# EAGLE design md (EAGLE 8.2.2)
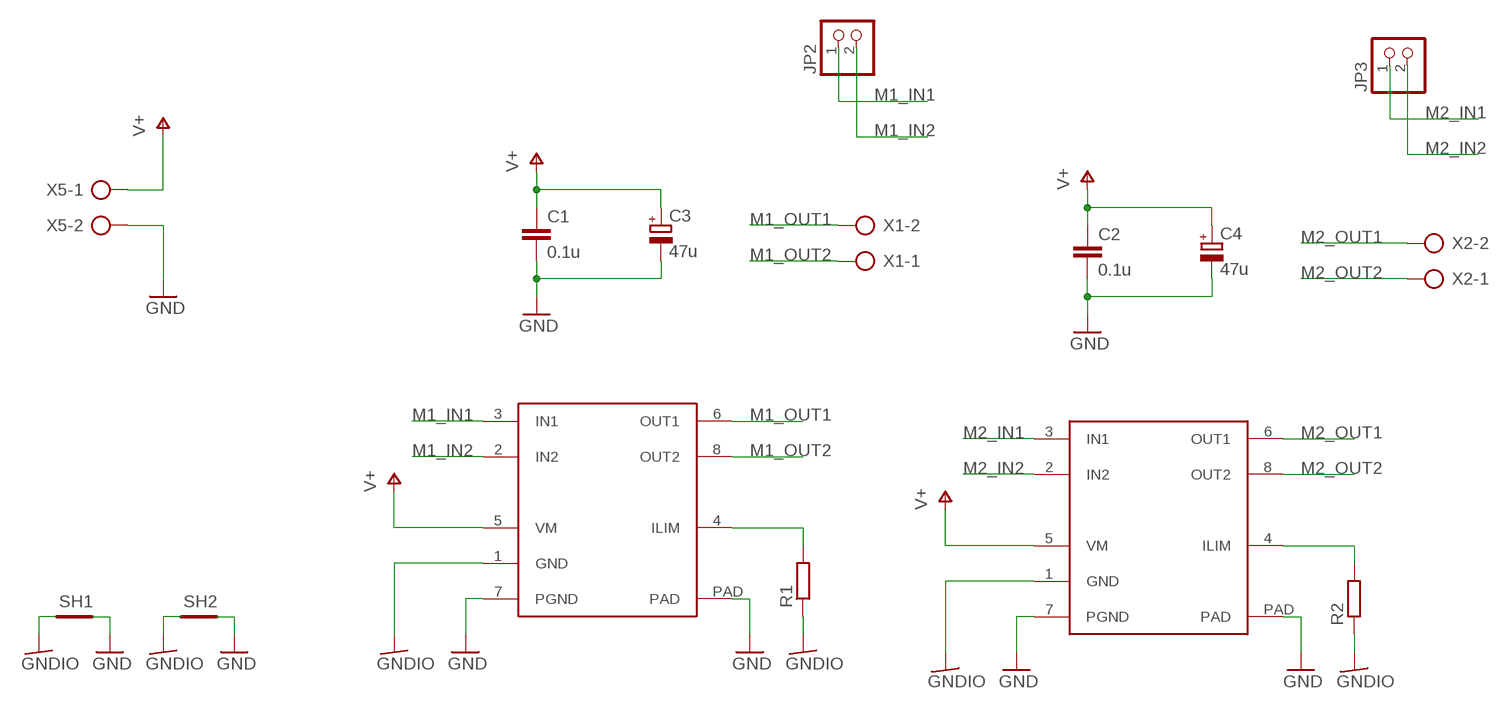
[diagram p0: schematic, sheet 1]

## Parts
C1  0.1u  C-EUC0805  [C0805]
C2  0.1u  C-EUC0805  [C0805]
C3  47u  CPOL-EUE2.5-7  [E2,5-7]
C4  47u  CPOL-EUE2.5-7  [E2,5-7]
JP2  PINHD-1X2  [1X02]
JP3  PINHD-1X2  [1X02]
MD1  DRV8871  [SO8-COOL]
MD2  DRV8871  [SO8-COOL]
R1  R-EU_0207/7  [0207/7]
R2  R-EU_0207/7  [0207/7]
SH1  SHORTT5  [SHORT_TOP-50]
SH2  SHORTT5  [SHORT_TOP-50]
X1  AK300/2  [AK300/2]
X2  AK300/2  [AK300/2]
X5  AK300/2  [AK300/2]

## Nets
GND: C1.2 C2.2 C3.- C4.- MD1.7(PGND) MD1.PAD MD2.7(PGND) MD2.PAD SH1.2 SH2.2 X5.2
GNDIO: MD1.1(GND) MD2.1(GND) R1.1 R2.1 SH1.1 SH2.1
M1_IN1: JP2.1 MD1.3(IN1)
M1_IN2: JP2.2 MD1.2(IN2)
M1_OUT1: MD1.6(OUT1) X1.2
M1_OUT2: MD1.8(OUT2) X1.1
M2_IN1: JP3.1 MD2.3(IN1)
M2_IN2: JP3.2 MD2.2(IN2)
M2_OUT1: MD2.6(OUT1) X2.2
M2_OUT2: MD2.8(OUT2) X2.1
N$1: MD1.4(ILIM) R1.2
N$2: MD2.4(ILIM) R2.2
V+: C1.1 C2.1 C3.+ C4.+ MD1.5(VM) MD2.5(VM) X5.1

## Library data of the parts
C1 C2 = rcl:C-EU: CAPACITOR, European symbol
C3 C4 = rcl:CPOL-EU: POLARIZED CAPACITOR, European symbol
JP2 JP3 = pinhead:PINHD-1X2: PIN HEADER
MD1 MD2 = default:DRV8871
R1 R2 = rcl:R-EU_: RESISTOR, European symbol
SH1 SH2 = shorts:SHORT: Short between two nets; BOM: no
X1 X2 X5 = con-ptr500:AK300/2: CONNECTOR; OC_FARNELL: unknown; OC_NEWARK: unknown

## Board
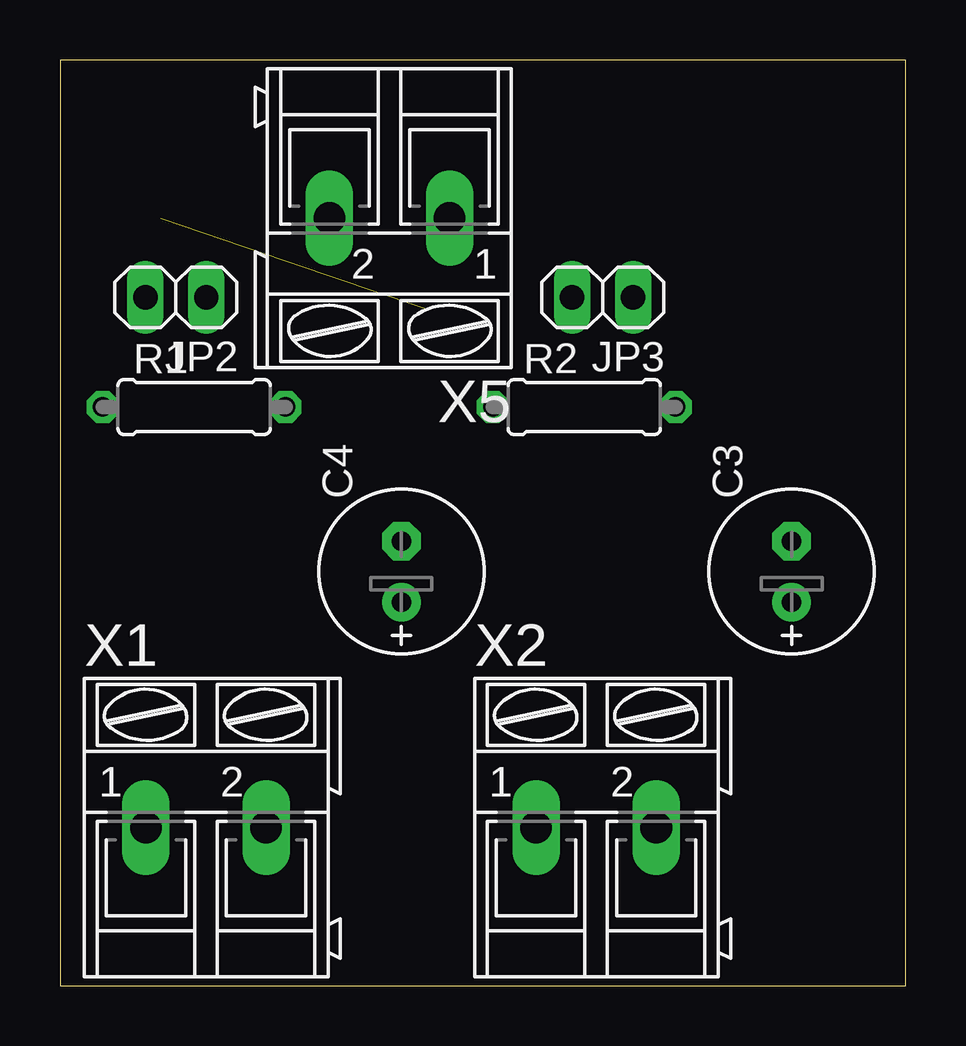
[diagram p1: board, top side]
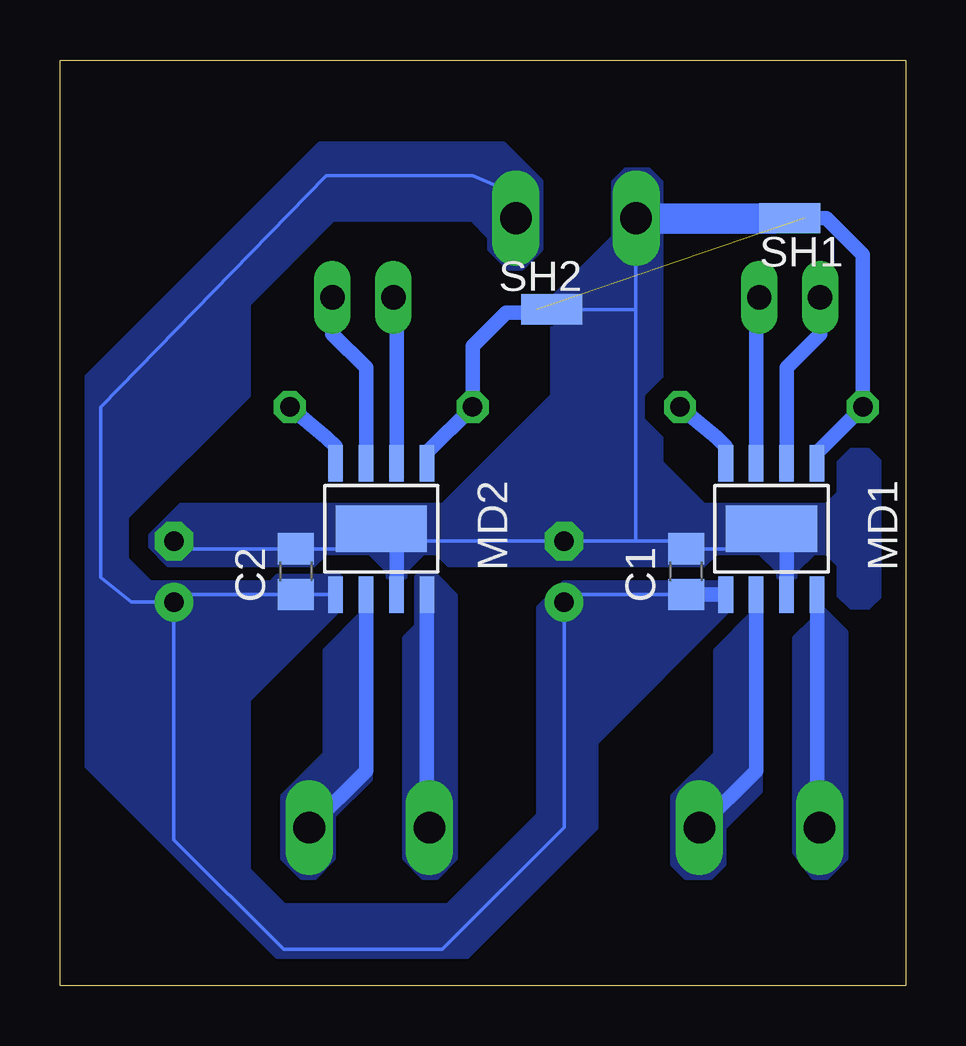
[diagram p2: board, bottom side, seen from below]

Size 35.23 x 38.6 mm. Coordinates in mm from the lower left corner, seen from the top.
Outline: 0,0 35.23,0 35.23,38.6 0,38.6 0,0
Copper layers (1*16): Top 0.035mm / dielectric 1.5mm / Bottom 0.035mm
Design rules "default *": minimum track width 6mil, minimum drill 0.35mm, track to track 3mil, track to pad 3mil, pad to pad 3mil, via to via 3mil, smd to smd 3mil, copper to edge 40mil, drill to drill 6mil, minimum pad ring 10mil, minimum via ring 8mil, stop-mask expansion 4mil, vias tented up to drill 0mil, thermal gap 10mil

### Footprints (pad centres in the part's own frame; a part is rotated, then mirrored left to right if it is on the bottom)
C0805 = smd 1.3 x 1.5: 1 -0.95,0; 2 0.95,0
E2,5-7 = drill 0.813 pad 1.6: + -1.27,0 | drill 0.813 pad 1.6 octagon: - 1.27,0
1X02 = drill 1.016 long: 1 -1.27,0; 2 1.27,0
SO8-COOL = smd 0.61 x 1.524: 1 -1.905,-2.743; 2 -0.635,-2.743; 3 0.635,-2.743; 4 1.905,-2.743; 5 1.905,2.743; 6 0.635,2.743; 7 -0.635,2.743; 8 -1.905,2.743 | smd 3.81 x 1.93: PAD 0,0
0207/7 = drill 0.813 octagon: 1 -3.81,0; 2 3.81,0
SHORT_TOP-50 = smd 1.27 x 1.27: 1 0.635,0; 2 -0.635,0
AK300/2 = drill 1.321 long: 1 -2.515,0; 2 2.489,0

### Placement (x,y rotation side)
C1  9.14,17.27 90 bottom
C2  25.4,17.27 90 bottom
C3  30.48,17.27 90 top
C4  14.22,17.27 90 top
JP2  4.83,28.7 180 top
JP3  22.61,28.7 180 top
MD1  5.59,19.05 180 bottom
MD2  21.84,19.05 180 bottom
R1  5.59,24.13 0 top
R2  21.84,24.13 0 top
SH1  4.83,32 0 bottom
SH2  14.73,28.19 180 bottom
X1  6.1,6.6 0 top
X2  22.35,6.6 0 top
X5  13.72,32 180 top

### Tracks (layer width: path | path; a pad name or v marks a point on that pad's centre or on a via)
GND
  Bottom 0.152: C3.- 30.16,18.22 C2.2 22.67,18.22 MD2.PAD 21.21,18.41 21.21,18.4 20.72,18.4 20.57,18.54 C4.- 11.25,18.54 | 4.95,18.41 MD1.PAD 6.42,18.22 C1.2 9.46,18.54 11.25,18.54 | X5.2 11.25,31.98 11.25,28.19 | 11.25,28.19 11.25,18.54 | SH1.2 5.48,31.98 | 11.25,28.19 SH2.2
  Bottom 0.61: 4.95,18.41 MD1.7 | 21.21,18.4 MD2.7
  Bottom 1.27: 5.48,31.98 11.25,31.98
  pour Bottom (no thermals): 8.38,20.07 3.3,20.07 2.79,20.57 2.79,21.84 2.29,22.35 1.52,22.35 1.02,21.84 1.02,16.26 1.52,15.75 2.29,15.75 2.79,16.26 2.79,17.53 3.3,18.03 3.81,18.03 4.57,17.27 4.57,17.02 5.33,17.02 5.33,17.27 6.1,18.03 7.87,18.03 8.38,17.53 19.05,17.53 19.56,18.03 20.07,18.03 20.83,17.27 20.83,17.02 21.59,17.02 21.59,17.27 22.35,18.03 24.13,18.03 24.64,17.53 30.73,17.53 31.5,18.29 31.5,18.8 30.23,20.07 19.3,20.07 14.73,24.64 14.73,28.7 12.19,31.24 12.19,33.53 11.68,34.04 10.67,34.04 10.16,33.53 10.16,25.4 10.92,24.64 10.92,23.62 10.16,22.86 10.16,21.84
GNDIO  (1 unrouted)
  Bottom 0.152: 3.68,22.23 MD1.1 | 19.94,22.23 MD2.1 | SH2.1 15.49,28.19 15.62,28.07
  Bottom 0.61: 3.68,22.23 R1.1 1.78,30.48 3.3,32 SH1.1 | 19.94,22.23 R2.1 18.03,26.67 16.64,28.07 15.62,28.07
M1_IN1
  Bottom 0.152: 6.22,28.57 JP2.1
  Bottom 0.61: MD1.3 6.22,28.57
M1_IN2
  Bottom 0.61: MD1.2 4.95,25.78 3.56,27.18 JP2.2
M1_OUT1
  Bottom 0.61: MD1.6 6.22,8.97 X1.2
  pour Bottom (no thermals): 6.1,16 6.1,8.13 7.62,6.6 7.62,5.08 8.13,4.57 9.14,4.57 9.65,5.08 9.65,7.87 7.87,9.65 7.87,13.97 6.35,15.49 6.35,16
M1_OUT2
  Bottom 0.152: 3.68,6.71 X1.1
  Bottom 0.61: MD1.8 3.68,6.71
  pour Bottom (no thermals): 3.56,15.75 2.54,14.73 2.54,5.33 3.3,4.57 3.81,4.57 4.57,5.59 4.57,14.48 3.81,15.24 3.81,15.75
M2_IN1
  Bottom 0.61: MD2.3 22.48,25.78 23.88,27.18 JP3.1
M2_IN2
  Bottom 0.152: 21.21,28.57 JP3.2
  Bottom 0.61: MD2.2 21.21,28.57
M2_OUT1
  Bottom 0.61: MD2.6 22.48,8.97 X2.2
  pour Bottom (no thermals): 22.35,16 22.35,8.64 23.88,7.11 23.88,5.33 24.64,4.57 25.15,4.57 25.91,5.33 25.91,7.87 24.13,9.65 24.13,13.97 22.61,15.49 22.61,16
M2_OUT2
  Bottom 0.152: 19.94,6.71 X2.1
  Bottom 0.61: MD2.8 19.94,6.71
  pour Bottom (no thermals): 19.56,17.02 18.8,16.26 18.8,5.59 18.8,5.33 19.56,4.57 20.07,4.57 20.83,5.33 20.83,14.48 20.32,14.99 20.32,17.02
N$1
  Bottom 0.152: MD1.4 7.49,22.48
  Bottom 0.61: 7.49,22.48 7.87,22.86 R1.2
N$2
  Bottom 0.152: MD2.4 23.75,22.48
  Bottom 0.61: 23.75,22.48 24.13,22.86 R2.2
V+
  Bottom 0.152: 9.13,16.31 C1.1 13.9,16.32 C4.+ 14.22,6.6 19.3,1.52 25.91,1.52 30.48,6.1 30.48,15.98 | MD2.5 25.39,16.31 C2.1 30.16,16.32 C3.+ 30.48,15.98 | X5.1 16.23,32.99 18.03,33.78 24.13,33.78 33.53,24.13 33.53,17.02 32.26,16 30.5,16 30.48,15.98
  Bottom 0.61: MD1.5 9.13,16.31
  pour Bottom (no thermals): 7.37,16.76 7.37,15.75 12.95,10.16 12.95,6.6 18.29,1.27 26.16,1.27 34.29,9.4 34.29,25.15 24.38,35.05 16.76,35.05 15.24,33.53 15.24,30.73 16,29.97 16.51,29.97 17.27,30.73 17.27,31.24 18.03,32 23.88,32 27.43,28.45 27.43,24.64 32.51,19.56 32.51,17.78 31.5,16.76 26.42,16.76 26.16,17.02 23.62,17.02 23.62,15.75 27.43,11.94 27.43,4.83 25.91,3.3 19.05,3.3 15.24,7.11 15.24,15.75 14.22,16.76